# EasyEDA Pro project OpenIPC-Optical(工程文件)2025-11-24.epro, board PCB1
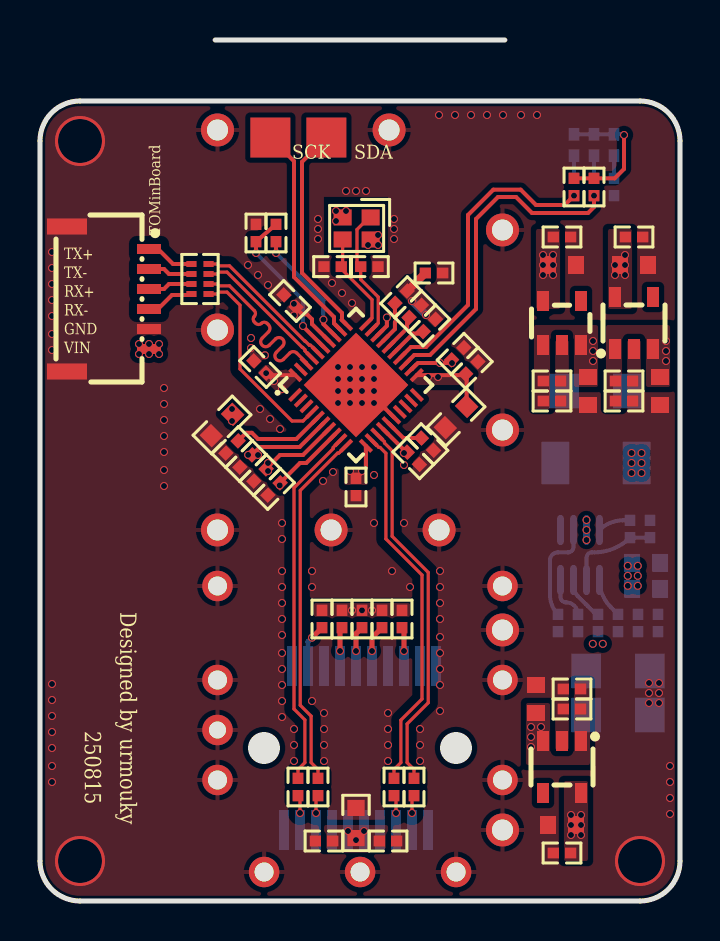
[diagram p5: board, top side]
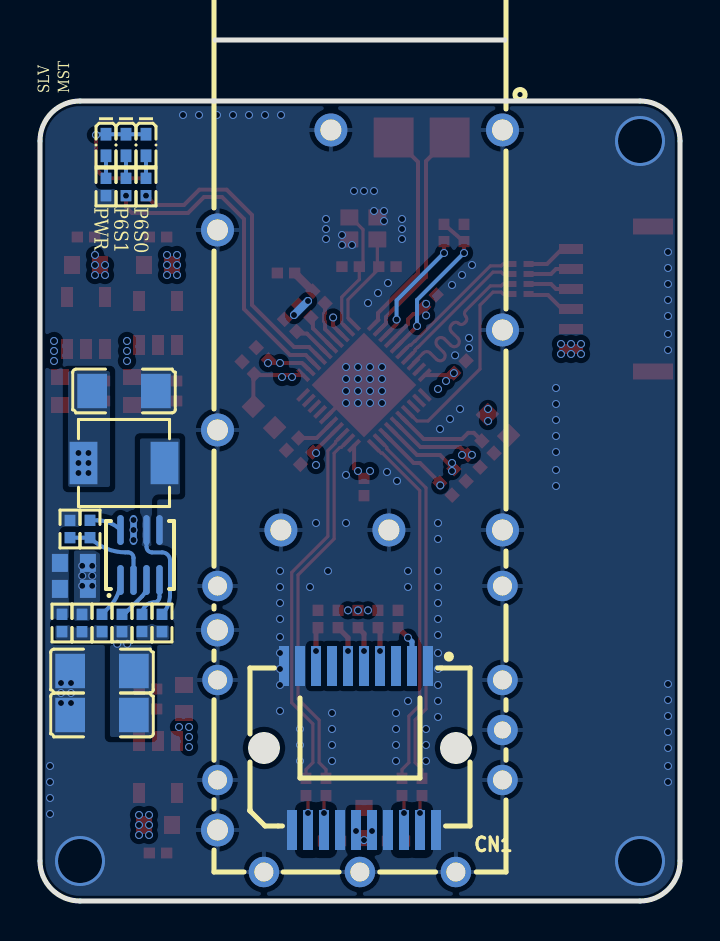
[diagram p6: board, bottom side, seen from below]

Outline 32 x 43.05 mm; copper layers: Top Layer, Inner1, Inner2, Bottom Layer. Coordinates in mm from the lower left corner of the outline.
Outline path: 0,38 0,2 arc(0.59,0.59) 2,0 30,0 arc(31.41,0.59) 32,2 32,38 arc(31.41,39.41) 30,40 2,40 arc(0.59,39.41) 0,38
Stack: Top Layer 0.035mm 外层铜厚1oz / Dielectric1 0.2104mm 7628 RC49% 8.6mil / Inner1 0.0152mm 内层铜厚 / Dielectric2 1.065mm 1.1mm H/HOZ Copper / Inner2 0.0152mm 内层铜厚 / Dielectric3 0.2104mm 7628 RC49% 8.6mil / Bottom Layer 0.035mm 外层铜厚1oz

## Design rules (mm)
net $1N1852: DP3
net $1N1912: DP3
net HSON: 100M以太网差分线, DP1
net SFP_TX_N: SFP差分线
net HSOP: 100M以太网差分线, DP1
net SFP_TX_P: SFP差分线
net HSIP: 100M以太网差分线, DP2
net SFP_RX_P: SFP差分线
net HSIN: 100M以太网差分线, DP2
net SFP_RX_N: SFP差分线
net P0MDICP: SFP差分线
net P0MDICN: SFP差分线
net P0MDIDP: SFP差分线
net P0MDIDN: SFP差分线, DP5
net P0MDIBN: SFP差分线
net P0MDIBP: SFP差分线, DP5
net P0MDIAN: SFP差分线, DP4
net P0MDIAP: SFP差分线, DP4
net ETH_RX-: 100M以太网差分线
net ETH_TX-: 100M以太网差分线
net ETH_RX+: 100M以太网差分线
net ETH_TX+: 100M以太网差分线
template: 自定义配置
spacing copperThickness1oz (default): track to track 0.102, other pairs 0.152 to 0.3
spacing copperThickness2oz: track to track 0.203, other pairs 0.152 to 0.3
spacing 高速信号: track to track 0.152, other pairs 0.152 to 0.3
track width copperThickness1oz (default): min 0.127, default 0.2, max 2.54
track width copperThickness2oz: min 0.203, default 0.254, max 2.54
differential pair differentialPair (default): width min 0.127, default 0.254, max 2.54; gap min 0.152, default 0.152
via viaSize (default): diameter min 0.4, default 0.4, max 10; hole min 0.3, default 0.3, max 6.3
net class SFP差分线 uses 高速信号
net class 100M以太网差分线 uses 高速信号
net HSON uses 高速信号
net SFP_TX_N uses 高速信号
net HSOP uses 高速信号
net SFP_TX_P uses 高速信号
net HSIP uses 高速信号
net SFP_RX_P uses 高速信号
net HSIN uses 高速信号
net SFP_RX_N uses 高速信号
net P0MDICP uses 高速信号
net P0MDICN uses 高速信号
net P0MDIDP uses 高速信号
net P0MDIDN uses 高速信号
net P0MDIBN uses 高速信号
net P0MDIBP uses 高速信号
net P0MDIAN uses 高速信号
net P0MDIAP uses 高速信号
net ETH_RX- uses 高速信号
net ETH_TX- uses 高速信号
net ETH_RX+ uses 高速信号
net ETH_TX+ uses 高速信号
['net class', '100m以太网差分线'] ['NET', 'GND'] uses copperThickness2oz
['net class', '100m以太网差分线'] ['NET', 'GND'] uses 高速信号
['net class', 'sfp差分线'] ['NET', 'GND'] uses 高速信号

## Placement (name value [footprint] x y rotation side)
C1  18pF  [R0402]  16.47 31.72 0 top
C2  18pF  [R0402]  14.63 31.72 0 top
C3  100nF  [R0402]  20.88 27.36 225 top
C4  100nF  [R0402]  11.7 20.6 45 top
C5  100nF  [R0402]  12.5 30 315 top
C6  100nF  [R0402]  15.8 20.7 90 top
C7  100nF  [R0402]  10.3 22 45 top
C8  100nF  [R0402]  11 26.7 315 top
C9  10uF  [R0603]  20.8 24.2 45 top
C10  100nF  [R0402]  10.8 33.4 270 top
C11  100nF  [R0402]  11 21.3 45 top
C12  100nF  [R0402]  19.7 31.4 180 top
C13  100nF  [R0402]  18.66 22.14 135 top
C14  100nF  [R0402]  21.59 26.66 225 top
C15  22uF  [C0603]  30.31 15.61 180 bottom
C18  47uF  [C1206]  28.9 9.3 180 bottom
C19  47uF  [C1206]  28.9 11.5 180 bottom
C20  100nF  [C0402]  26.9 13.9 270 bottom
C46  100nF  [R0402]  29.2 26 0 top
C68  100nF  [R0402]  17.4 3 180 top
C69  1uF  [R0603]  15.8 3.9 270 top
C70  100nF  [R0402]  12.9 5.7 90 top
C71  100nF  [R0402]  13.9 5.7 90 top
C72  100nF  [R0402]  17.7 5.7 90 top
C73  100nF  [R0402]  18.7 5.7 90 top
C75  10uF  [R0603]  9.1 23.8 45 top
C76  100nF  [R0402]  14.2 3 0 top
C77  22uF  [C0603]  30.31 16.91 180 bottom
C78  100nF  [C0402]  30.5 18.6 270 bottom
C80  22uF  [C0603]  29.7 31.8 180 top
C81  100nF  [R0402]  29.2 25 180 top
C84  22uF  [C0603]  26.1 3.8 0 top
C85  100nF  [R0402]  26.6 10.6 0 top
C88  100nF  [R0402]  26.6 9.6 180 top
C93  47uF  [C1206]  27.8 25.5 180 bottom
C94  22uF  [C0603]  24.8 10.1 270 top
C95  22uF  [C0603]  31 25.5 90 top
C96  100nF  [R0402]  29.7 33.2 0 top
C97  100nF  [R0402]  26.1 2.4 180 top
C98  22uF  [C0603]  26.1 31.8 180 top
C99  100nF  [R0402]  25.6 25 180 top
C100  100nF  [R0402]  25.6 26 0 top
C101  22uF  [C0603]  27.4 25.5 90 top
C102  100nF  [R0402]  26.1 33.2 0 top
CN1  HC-SFP-20P  [CONN-SMD_20P-P0.80_HCTL_HC-SFP-20P]  16 7.65 0 bottom
L1  10uH  [IND-SMD_L4.4-W4.2]  27.8 21.9 180 bottom
P6S0  NCD0402G1  [LED0402-RD]  26.7 37.8 270 bottom
P6S1  NCD0402G1  [LED0402-RD]  27.7 37.8 270 bottom
PWR  NCD0402G1  [LED0402-RD]  28.7 37.8 270 bottom
R1  4.7kΩ  [R0402]  18.05 30.19 45 top
R2  4.7kΩ  [R0402]  19.47 28.78 225 top
R3  4.7kΩ  [R0402]  26.7 35.7 90 top
R4  4.7kΩ  [R0402]  27.7 35.7 90 top
R5  470Ω  [R0402]  27.7 35.7 90 bottom
R6  470Ω  [R0402]  26.7 35.7 90 bottom
R9  2.49kΩ  [R0402]  9.6 22.7 45 top
R10  4.7kΩ  [R0402]  11.8 33.4 90 top
R11  4.7kΩ  [R0402]  19.37 22.84 135 top
R16  51kΩ  [R0402]  28.9 13.9 270 bottom
R17  41.2kΩ  [R0402]  29.9 13.9 90 bottom
R20  7.68kΩ  [R0402]  30.9 13.9 270 bottom
R82  10kΩ  [R0402]  14.1 14.1 90 top
R83  10kΩ  [R0402]  15.1 14.1 90 top
R86  10kΩ  [R0402]  16.1 14.1 90 top
R87  10kΩ  [R0402]  17.1 14.1 90 top
R90  10kΩ  [R0402]  18.1 14.1 90 top
R95  4.7kΩ  [R0402]  18.76 29.48 45 top
R96  1MΩ  [R0402]  27.9 13.9 90 bottom
R97  100kΩ  [R0402]  29.5 18.6 90 bottom
R98  20Ω  [R0402]  25.9 13.9 270 bottom
R99  470Ω  [R0402]  28.7 35.7 90 bottom
RN1  49.9Ω  [RES-ARRAY-SMD_0402-8P-L2.0-W1.0-BL]  8 31.1 90 top
SCK  -  [Test-Point-0.5mm]  11.52 38.17 0 top
SDA  -  [Test-Point-0.5mm]  14.32 38.17 0 top
TOMinBoard  HDGC1002WR-S-6P  [CONN-SMD_6P-P1.00_HDGC1002WR-S-6P]  3.4 30.1 270 top
U1  RTL8213B-CG  [QFN-40_L5.0-W5.0-P0.40-BL-EP3.7]  15.8 25.8 315 top
U2  MP9943GQ-Z  [QFN-8_L3.0-W3.0-P0.65-BL]  27 17.3 180 bottom
U6  HC-SFP-01L  [TH_HC-SFP-01L]  16 20 270 bottom
U7  ME6217C33M5G  [SOT-23-5_L3.0-W1.7-P0.95-LS2.8-BR]  29.7 28.9 270 top
U8  ME6217C33M5G  [SOT-23-5_L3.0-W1.7-P0.95-LS2.8-BR]  26.1 6.7 90 top
U10  TLV74018PDBVR  [SOT-23-5_L2.9-W1.6-P0.95-LS2.8-BL]  26.1 28.9 0 top
X2  25MHz  [CRYSTAL-SMD_4P-L2.0-W1.6-BL]  15.83 33.63 180 top

## Footprints (pads in the part's own frame, mm; a bottom-side part is the same pattern mirrored in y, then rotated)
C0402
  rect 0.567x0.54 smd: 1(-0.432,0) 2(0.432,0)
C0603
  rect 0.8x0.9 smd: 1(-0.7,0) 2(0.7,0)
C1206
  rect 1.485x1.728 smd: 1(-1.593,0) 2(1.593,0)
CONN-SMD_6P-P1.00_HDGC1002WR-S-6P
  rect 0.5x1.2 smd: 1(-2.5,2.05) 2(-1.5,2.05) 3(-0.5,2.05) 4(0.5,2.05) 5(1.5,2.05) 6(2.5,2.05)
  rect 0.8x2 smd: 7(3.625,-2.05) 8(-3.625,-2.05)
CONN-SMD_20P-P0.80_HCTL_HC-SFP-20P
  rect 0.5x2 smd: 1(-3.4,-4.1) 2(-2.6,-4.1) 3(-1.8,-4.1) 4(-1,-4.1) 5(-0.2,-4.1) 6(0.6,-4.1) 7(1.4,-4.1) 8(2.2,-4.1) 9(3,-4.1) 10(3.8,-4.1) 11(3.4,4.1) 12(2.6,4.1) 13(1.8,4.1) 14(1,4.1) 15(0.2,4.1) 16(-0.6,4.1) 17(-1.4,4.1) 18(-2.2,4.1) 19(-3,4.1) 20(-3.8,4.1)
CRYSTAL-SMD_4P-L2.0-W1.6-BL
  rect 0.9x0.8 smd: 1(-0.7,-0.55) 2(0.7,-0.55) 3(0.7,0.55) 4(-0.7,0.55)
IND-SMD_L4.4-W4.2
  rect 1.4x2.12 smd: 1(2.028,0) 2(-2.028,0)
LED0402-RD
  rect 0.636x0.54 smd: 1(-0.538,0) 2(0.538,0)
QFN-8_L3.0-W3.0-P0.65-BL
  oval 0.33x1.5 smd: 1(-0.975,-1.25) 2(-0.325,-1.25) 3(0.325,-1.25) 4(0.975,-1.25) 5(0.975,1.25) 6(0.325,1.25) 7(-0.325,1.25) 8(-0.975,1.25)
QFN-40_L5.0-W5.0-P0.40-BL-EP3.7
  rect 0.2x0.8 smd: 1(-1.8,-2.499) 2(-1.4,-2.499) 3(-1,-2.499) 4(-0.6,-2.499) 5(-0.2,-2.499) 6(0.2,-2.499) 7(0.6,-2.499) 8(1,-2.499) 9(1.4,-2.499) 10(1.8,-2.499) 21(1.8,2.499) 22(1.4,2.499) 23(1,2.499) 24(0.6,2.499) 25(0.2,2.499) 26(-0.2,2.499) 27(-0.6,2.499) 28(-1,2.499) 29(-1.4,2.499) 30(-1.8,2.499)
  rect 0.8x0.2 smd: 11(2.499,-1.8) 12(2.499,-1.4) 13(2.499,-1) 14(2.499,-0.6) 15(2.499,-0.2) 16(2.499,0.2) 17(2.499,0.6) 18(2.499,1) 19(2.499,1.4) 20(2.499,1.8) 31(-2.499,1.8) 32(-2.499,1.4) 33(-2.499,1) 34(-2.499,0.6) 35(-2.499,0.2) 36(-2.499,-0.2) 37(-2.499,-0.6) 38(-2.499,-1) 39(-2.499,-1.4) 40(-2.499,-1.8)
  rect 3.7x3.7 smd: 41(0,0)
R0402
  rect 0.566x0.54 smd: 1(-0.433,0) 2(0.433,0)
R0603
  rect 0.806x0.864 smd: 1(-0.753,0) 2(0.753,0)
RES-ARRAY-SMD_0402-8P-L2.0-W1.0-BL
  rect 0.3x0.505 smd: 1(-0.75,0.427) 2(-0.25,0.427) 3(0.25,0.427) 4(0.75,0.427) 5(0.75,-0.427) 6(0.25,-0.427) 7(-0.25,-0.427) 8(-0.75,-0.427)
SOT-23-5_L2.9-W1.6-P0.95-LS2.8-BL
  rect 0.6x1 smd: 1(-0.95,-1.1) 2(0,-1.1) 3(0.95,-1.1) 4(0.95,1.1) 5(-0.95,1.1)
SOT-23-5_L3.0-W1.7-P0.95-LS2.8-BR
  rect 1x0.6 smd: 1(1.3,-0.95) 2(1.3,0) 3(1.3,0.95) 4(-1.3,0.95) 5(-1.3,-0.95)
Test-Point-0.5mm
  rect 2x2 smd: 1(0,0)
TH_HC-SFP-01L
  round 1.65 hole 1.05: 1(-18.55,7.125) 2(-8.55,7.125) 3(1.45,7.125) 11(16.45,-7.125) 14(6.45,-7.125) 16(-3.55,-7.125) 17(-13.55,-7.125) 18(-18.55,-1.455) 19(1.45,-3.955) 20(1.45,1.445)
  round 1.524 hole 0.95: 4(4.25,7.125) 5(8.95,7.125) 7(13.95,7.125) 8(18.55,4.795) 9(18.55,-0.005) 10(18.55,-4.805) 12(13.95,-7.125) 13(8.95,-7.125) 15(4.25,-7.125)
  round 1.524 hole 0.85: 6(11.45,7.125)

## Nets
As in the schematic.

Pads without a net: CN1 3 7; U1 17 18 19 20; U7 4; U8 4; U10 4

## Via types
v1: diameter 0.4, hole 0.3, Top Layer to Bottom Layer, 221 vias
v2: diameter 2.5, hole 2.2, Top Layer to Bottom Layer, 3 vias

## Routing (per net, layer and track width the routed paths; a pad name or vN(x,y) marks a point on that pad's centre or on a via; arc(x,y) is an arc through that point)
4V5:
  vias: v1(24.55,8.7) v1(24.55,8.2) v1(24.55,7.7) v1(25.05,8.7) v1(27.65,28) v1(27.65,27.5) v1(27.65,27) v1(29.39,16.76) v1(29.39,16.26) v1(29.39,15.76) v1(29.58,22.4) v1(29.58,21.9) v1(29.58,21.4) v1(29.89,16.76) v1(29.89,16.26) v1(29.89,15.76) v1(30.08,22.4) v1(30.08,21.9) v1(30.08,21.4) v1(31.3,28) v1(31.3,27.5) v1(31.3,27)
GND: length 2.6
  Top Layer w0.2: U1.16 16.08,25.8 U1.41
  vias: v1(0.6,32.45) v1(0.6,31.65) v1(0.6,30.85) v1(0.6,30.05) v1(0.6,29.25) v1(0.6,28.35) v1(0.6,27.55) v1(0.6,10.85) v1(0.6,10.05) v1(0.6,9.25) v1(0.6,8.45) v1(0.6,7.65) v1(0.6,6.75) v1(0.6,5.95) v1(6.2,25.65) v1(6.2,24.85) v1(6.2,24.05) v1(6.2,23.25) v1(6.2,22.45) v1(6.2,21.55) v1(6.2,20.75) v1(10.4,31.8) v1(10.55,28.15) v1(10.55,27.65) v1(10.9,31.3) v1(11,24.6) v1(11.25,27.29) v1(11.4,30.8) v1(11.5,24.1) v1(12,23.6) v1(12.1,18.9) v1(12.1,18.1) v1(12.1,16.5) v1(12.1,15.7) v1(12.1,14.9) v1(12.1,14.1) v1(12.1,13.3) v1(12.1,12.4) v1(12.1,11.6) v1(12.1,10.8) v1(12.1,10) v1(12.1,9.2) v1(12.7,8.6) v1(12.7,7.8) v1(12.7,7) v1(13.6,16.5) v1(13.6,15.7) v1(13.6,10) v1(13.9,34.1) v1(13.9,33.6) v1(13.9,33.1) v1(14.15,21) v1(14.2,9.4) v1(14.2,8.6) v1(14.2,7.8) v1(14.2,7) v1(14.6,30.9) v1(14.65,21.45) v1(14.8,34.5) v1(14.8,34) v1(14.9,26.7) v1(14.9,26.1) v1(14.9,25.5) v1(14.9,24.9) v1(15.1,30.4) v1(15.3,35.5) v1(15.3,34.5) v1(15.5,26.7) v1(15.5,26.1) v1(15.5,25.5) v1(15.5,24.9) v1(15.6,29.9) v1(15.8,35.5) v1(16.1,26.7) v1(16.1,26.1) v1(16.1,25.5) v1(16.1,24.9) v1(16.3,35.5) v1(16.4,32.8) v1(16.7,26.7) v1(16.7,26.1) v1(16.7,25.5) v1(16.7,24.9) v1(16.7,21.3) v1(16.7,18.9) v1(16.9,33.3) v1(16.9,32.8) v1(17.4,9.4) v1(17.4,8.6) v1(17.4,7.8) v1(17.4,7) v1(17.6,16.5) v1(17.7,34.1) v1(17.7,33.6) v1(17.7,33.1) v1(18.2,18.9) v1(18.5,15.7) v1(19,8.6) v1(19,7.8) v1(19,7) v1(19.95,39.3) v1(20,16.5) v1(20,15.7) v1(20,14.9) v1(20,14.1) v1(20,13.2) v1(20,12.4) v1(20,11.6) v1(20,10.8) v1(20,9.5) v1(20.75,39.3) v1(21.55,39.3) v1(22.35,39.3) v1(23.15,39.3) v1(24.05,39.3) v1(24.85,39.3) v1(30.45,10.9) v1(30.45,10.4) v1(30.45,9.9) v1(30.95,10.9) v1(30.95,10.4) v1(30.95,9.9) v1(31.5,6.75) v1(31.5,5.95) v1(31.5,5.15) v1(31.5,4.35) v2(2,38) v2(2,2) v2(30,2)
VBAT: length 38.9
  Inner2 w0.2: v1(28.14,12.86) v1(27.64,12.86) arc(27.41,13.21) 27.32,13.62 v1(27.32,18.05) v1(27.32,18.55) v1(27.32,19.05)
  Inner2 w0.7: v1(5.45,27.85) v1(5.45,27.35) 5.45,18.45 6.7,17.2 26.48,17.2 v1(27.32,18.05)
  vias: v1(4.95,27.85) v1(4.95,27.35) v1(5.95,27.85) v1(5.95,27.35)
8213B_1V0: length 50.3
  Top Layer w0.2: 20.47,26.96 20.42,26.9 v1(20,26.9) 18.9,26.9 18.59,26.59 arc(18.58,26.58) U1.22 ; U1.11 16.29,21.63 15.8,21.13 ; U1.40 11.61,26.29 11.51,26.19 ; C5.2 12.81,29.64 13.1,29.35 13.34,29.35 13.6,29.09 13.6,28.85 U1.34 ; C7.2 11,22.7 12.98,22.7 U1.6 ; U1.8 13.31,21.9 13,21.9 C4.2
  Inner2 w0.2: v1(20,26.9) 20.7,26.9
  Inner2 w0.4: 12,20.4 11.4,20.4 9.6,22.2 9.6,22.3 ; 12,20.4 18.1,20.4 19.3,21.6 19.3,24.2 25.15,30.05 v1(25.15,31.3) ; 12,20.4 12,20.77 v1(11.99,20.78) ; v1(10.9,22.3) 9.6,22.3 ; 9.6,22.3 v1(9.6,24)
  Inner2 w0.5: v1(25.65,31.8) v1(25.15,31.3) ; 10,24.1 9.6,24.5 v1(9.6,24.6) 9.6,24.69 v1(11.31,26.39) 12,27.09 12,28.58 v1(12.7,29.28)
  vias: v1(10.41,22.31) v1(11.7,26) v1(12.1,25.6) v1(12.7,29.86) v1(15.5,21.5) v1(16.1,21.5) v1(20.6,26.9) v1(25.15,32.3) v1(25.15,31.8) v1(25.65,32.3) v1(25.65,31.3)
8213B_3V3: length 70.6
  Top Layer w0.2: C11.2 12,22.3 13.15,22.3 U1.7 ; U1.14 18.31,22.44 18.36,22.44 ; 11.8,33.83 C10.2 v1(10.8,32.4) ; U1.35 13.15,28.73 v1(13.15,28.75) ; v1(29.2,38.3) 29.2,36.6 28.73,36.13 26.7,36.13 ; U1.21 21.14,26.29 21.33,26.1 C9.2 ; U1.28 17.34,28.76 v1(17.34,29.18)
  Top Layer w0.4: C12.2 18.37,30.5 18.36,30.5
  Inner2 w0.5: v1(29.2,38.3) 29.25,38.25 v1(29.25,32.3) 28.75,32.3 v1(28.75,31.8) ; 13.6,28.3 v1(13.15,28.75) ; 18.9,26.2 v1(19.4,26.2) v1(19.9,26.2) ; 18.9,26.2 19.3,26.6 19.3,27.7 20.1,28.5 ; 18.9,26.2 17,24.3 ; 17,24.3 18.2,23.1 v1(18.2,22.4) v1(18.2,21.8) ; 17,24.3 15.9,23.2 12.65,23.2 11.4,21.95 v1(11.4,21.5) ; 13.6,28.3 16.47,28.3 v1(17.34,29.18) 18.17,30 v1(18.6,30) ; 20.1,28.5 v1(19.3,29.3) ; 20.1,28.5 24.9,33.3 26.1,33.3 27.6,31.8 v1(28.75,31.8) ; v1(28.75,31.8) v1(29.25,31.8)
  Bottom Layer w0.2: v1(29.2,38.3) 29.16,38.34 PWR.1 P6S1.1 P6S0.1 ; v1(10.8,32.4) 13.15,30.05 v1(13.15,28.75)
  Bottom Layer w0.4: v1(19.3,29.3) v1(18.6,30)
  vias: v1(11.4,21.9) v1(28.75,31.3) v1(29.25,31.3)
8213B_EN_SWR: length 1.9
  Top Layer w0.2: U1.15 18.17,23.15 R11.2
8213B_SCK: length 11.1
  Top Layer w0.2: U1.32 14.7,28.88 14.7,29.2 12.7,31.2 12.7,36.99 SCK.1
8213B_SDA: length 10.8
  Top Layer w0.2: SDA.1 13.1,36.96 13.1,31.4 15.1,29.4 15.1,29.05 U1.31
ETH_RX+: length 2.2
  Top Layer w0.2: TOMinBoard.3 6.2,30.6 6.45,30.85 RN1.2
ETH_RX-: length 2.4
  Top Layer w0.2: RN1.1 7.52,30.3 6.6,30.3 5.9,29.6 TOMinBoard.4
ETH_TX+: length 2.4
  Top Layer w0.2: RN1.4 6.65,31.85 5.9,32.6 TOMinBoard.1
ETH_TX-: length 2.2
  Top Layer w0.2: RN1.3 6.45,31.35 6.2,31.6 TOMinBoard.2
FB_5V: length 2
  Bottom Layer w0.2: 28.9,14.33 28.54,14.7 arc(28.12,15.32) U2.1
HSIN: length 18.8
  Top Layer w0.16: U1.13 17.22,22.96 17.22,22.9 17.61,22.52 17.61,18.23 19.41,16.43 19.41,9.91 18.36,8.86 18.36,6.92 18.7,6.58 18.7,6.13
HSIP: length 18.6
  Top Layer w0.16: U1.12 16.94,22.68 17,22.68 17.29,22.39 17.29,18.11 19.1,16.3 19.1,10.1 18.04,9.04 18.04,6.92 17.7,6.58 17.7,6.13
HSON: length 18.2
  Top Layer w0.16: U1.9 14.66,22.68 14.66,22.62 12.7,20.66 12.7,9.6 13.24,9.06 13.24,6.92 12.9,6.58 12.9,6.13
HSOP: length 18
  Top Layer w0.16: 13.9,6.13 13.9,6.58 13.56,6.92 13.56,9.24 13.01,9.79 13.01,20.53 14.88,22.4 14.94,22.4 U1.10
LC_5V: length 5.2
  Bottom Layer w0.2: U2.6 26.68,17.71 arc(26.59,17.51) 26.4,17.43 25.9,17.43 arc(25.62,17.31) 25.5,17.03 25.5,15.3 arc(25.6,14.78) 25.9,14.33
P0MDIAN: length 7
  Top Layer w0.16: RN1.6 8.84,31.35 8.93,31.44 9.35,31.44 13.11,27.68 13.13,27.68 13.25,27.57 13.25,27.51 U1.37
P0MDIAP: length 7.3
  Top Layer w0.16: U1.36 13.53,27.79 13.47,27.79 13.26,27.99 13.24,27.99 9.48,31.76 8.93,31.76 8.84,31.85 RN1.5
P0MDIBP: length 9.9
  Top Layer w0.16: U1.38 13.33,26.91 12.84,27.4 arc(12.66,27.47) 12.48,27.4 12.17,27.08 arc(11.82,27.08) 11.82,27.44 12.13,27.75 arc(12.13,28.1) 11.78,28.1 11.46,27.79 arc(11.11,27.79) 11.11,28.14 11.42,28.46 arc(11.5,28.63) 11.42,28.81 11.35,28.88 arc(11.21,28.94) 11.07,28.88 arc(10.93,28.82) 10.79,28.88 10.72,28.95 arc(10.66,29.09) 10.72,29.24 arc(10.77,29.38) 10.72,29.52 9.48,30.76 8.93,30.76 8.84,30.85 RN1.7
P0MDIDN: length 9.9
  Top Layer w0.16: U1.4 13.15,24 12.6,24 10,26.6 10,29.79 9.35,30.44 8.93,30.44 8.84,30.35 RN1.8
P3LED0: length 2.2
  Top Layer w0.2: U1.27 17.75,28.59 17.75,28.94 17.8,28.99 17.8,29.36 17.75,29.41 R1.1
P3LED1: length 1.8
  Top Layer w0.2: U1.26 18.35,28.64 18.35,29.08
P3LED2: length 1.7
  Top Layer w0.2: U1.25 18.65,28.37 19.06,28.37
P6LED0: length 15.3
  Top Layer w0.2: v1(26.7,35.27) 26.23,34.8 24.8,34.8 24.03,35.57 22.67,35.57 21.4,34.3 21.4,29.8 19.3,27.7 18.55,27.7 U1.24
P6LED1: length 16.5
  Top Layer w0.2: U1.23 18.71,27.3 19.5,27.3 21.8,29.6 21.8,34.1 22.9,35.2 23.8,35.2 24.6,34.4 27.4,34.4 27.7,34.7 v1(27.7,35.27)
SFP_3V3:
  vias: v1(15.4,3.5) v1(15.6,14.53) v1(15.8,3.05) v1(16.1,14.53) v1(16.2,3.5) v1(16.6,14.53) v1(26.55,4.3) v1(26.55,3.8) v1(26.55,3.3) v1(27.05,4.3) v1(27.05,3.8) v1(27.05,3.3)
SFP_RX_N: length 0.9
  Top Layer w0.16: v1(18.6,4.4) 18.6,5.17 C73.1
SFP_RX_P: length 0.9
  Top Layer w0.16: v1(17.8,4.4) 17.8,5.17 C72.1
SFP_TX_N: length 0.9
  Top Layer w0.16: v1(13,4.4) 13,5.17 C70.1
SFP_TX_P: length 0.9
  Top Layer w0.16: C71.1 13.8,5.17 v1(13.8,4.4)
$1N1852: length 6.5
  Top Layer w0.16: U1.29 16.91,28.89 16.91,30.2 16.03,31.08 C1.1 15.85,31.9 15.85,33.57 16.45,34.18 X2.1
$1N1863: length 5.9
  Top Layer w0.2: v1(14.17,29.07) 14.17,28.84 U1.33 ; v1(11.8,32.4) R10.1
  Bottom Layer w0.2: v1(14.17,29.07) 14.17,30.03 v1(11.8,32.4)
$1N1904: length 4.7
  Top Layer w0.2: U1.5 12.82,23.1 10.9,23.1 10.59,23.41 10.31,23.41 R9.2
$1N1912: length 5
  Top Layer w0.16: U1.30 16.6,29.15 16.6,30.07 15.06,31.61 C2.2 15.13,31.79 X2.3
$1N1945: length 1.1
  Bottom Layer w0.2: 27.7,36.13 P6S1.2
$1N1946: length 1.1
  Bottom Layer w0.2: P6S0.2 26.7,36.13
$1N2817: length 1.3
  Top Layer w0.254: 16.1,13.67 15.8,13.37 v1(15.8,12.5)
$1N2818: length 1.2
  Top Layer w0.254: v1(15,12.5) 15,13.57 15.1,13.67
$1N2820: length 1.4
  Top Layer w0.254: v1(16.6,12.5) 16.6,13.17 17.1,13.67
$1N2821: length 2.2
  Top Layer w0.254: 14.1,13.67 v1(13.6,13.17)
  Bottom Layer w0.254: CN1.2 13.4,12.97 v1(13.6,13.17)
$1N2827: length 1.2
  Top Layer w0.254: 18.1,13.67 18.2,13.57 v1(18.2,12.5)
$1N6453: length 1.1
  Bottom Layer w0.2: PWR.2 28.7,36.13
$2N900: length 1.7
  Bottom Layer w0.2: R97.2 29.14,19.03 arc(28.51,18.91) U2.8
$2N903: length 4.6
  Bottom Layer w0.2: U2.2 27.32,17.16 arc(27.41,17.35) 27.6,17.43 27.72,17.43 arc(28.68,17.62) 29.5,18.17 30.5,18.17 arc(30.5,18.17) C78.2
$2N915: length 2.2
  Bottom Layer w0.2: U2.4 26.03,15.21 arc(26.11,15.01) 26.3,14.93 arc(26.72,14.76) C20.1
$2N918: length 2.2
  Bottom Layer w0.2: U2.3 26.68,15.78 arc(26.73,15.48) 26.9,15.23 27.3,14.83 arc(27.35,14.79) 27.38,14.75 27.73,14.4 arc(27.81,14.35) 27.9,14.33

## Copper pours and planes (outline as drawn; the poured copper is in the pictures)
4V5 on Top Layer: 31.5,25.7 30.3,25.7 30.3,28.1 30.1,28.3 29.3,28.3 29.1,28.1 29.1,24.6 28.3,24.6 28.3,28.8 31.5,28.8
4V5 on Top Layer: 24.3,9.9 25.5,9.9 25.5,7.5 25.7,7.3 26.5,7.3 26.7,7.5 26.7,11 27.5,11 27.5,6.8 24.3,6.8
4V5 on Top Layer: 27.9,25.7 26.7,25.7 26.7,28.1 26.5,28.3 25.7,28.3 25.5,28.1 25.5,24.6 24.7,24.6 24.7,28.8 27.9,28.8
4V5 on Bottom Layer: 29.5,13.93 30.3,13.93 30.3,17.53 29,17.53 29,14.93 29.5,14.93
4V5 on Bottom Layer: 28.5,26.5 28.5,20.7 30.6,20.7 30.6,26.5
4V5 on Inner2: 29.34,22.66 29.34,17.6 29.31,17.47 29.17,17.25 29.14,17.12 29.14,15.46 30.14,15.46 30.14,20.52 30.17,20.65 30.31,20.87 30.34,21 30.34,22.66
4V5 on Inner2: 28.9,22.4 28.9,11.2 26.6,11.2 26.6,10.1 24.2,10.1 24.2,7.3 32,7.3 32,22.4
4V5 on Inner2: 26.6,28.4 32,28.4 32,22.2 27.1,22.2 24.5,24.8 24.5,26.3
GND on Top Layer: 0,40 32,40 32,0 0,0
GND on Bottom Layer: 0,40 32,40 32,0 0,0
GND on Inner1: 0,40 32,40 32,0 0,0
GND on Inner2: 0,40 32,40 32,0 0,0
VBAT on Bottom Layer: 28.5,12.8 28.5,8.2 26.4,8.2 26.4,12.8
VBAT on Bottom Layer: 27.44,13.86 27.44,12.66 28.34,12.66 28.34,13.86
VBAT on Inner2: 6.2,28.1 4.7,28.1 4.7,27.1 6.2,27.1
VBAT on Inner2: 28.8,19.6 28.8,12.4 26.4,12.4 26.4,19.6
8213B_1V0 on Top Layer: 10.7,26.3 12,25 13.1,26.1 12.4,26.8 11.2,26.8
8213B_1V0 on Top Layer: 26,33.6 24.8,33.6 24.8,29.6 26,29.6
8213B_1V0 on Top Layer: 12.8,30.3 12.1,29.6 12.9,28.8 13.6,29.5
8213B_1V0 on Top Layer: 15.2,21.7 16.4,21.7 16.4,20.8 15.2,20.8
8213B_1V0 on Inner2: 15.2,21.7 16.4,21.7 16.4,20.4 15.2,20.4
8213B_1V0 on Inner2: 24.8,32.6 26,32.6 26,31 24.8,31
8213B_1V0 on Inner2: 9.8,22.2 11.5,22.2 11.5,20.5
8213B_1V0 on Inner2: 19.8,27.1 19.8,26.5 21.9,26.5 21.9,27.1
8213B_1V0 on Inner2: 32,40 32,28.6 26.5,28.6 24.4,26.5 24.4,21.3 22.5,19.4 6.6,19.4 6.6,40
8213B_3V3 on Top Layer: 20.3,29.2 19.7,28.6 17.8,30.5 18.4,31.1
8213B_3V3 on Top Layer: 18.84,26.35 21.28,26.35 21.28,25.82 21.3,25.8 18.8,25.8 18.6,26 18.84,26.24
8213B_3V3 on Top Layer: 29.6,33.6 28.4,33.6 28.4,29.6 29.6,29.6
8213B_3V3 on Inner2: 12.5,28.1 12.5,26.8 10.7,25 10.7,22.5 11.6,22.5 11.7,22.4 11.7,20.9 17.9,20.9 18.7,21.7 18.7,24.3 24.4,30 24.4,32.3 25,32.9 26,32.9 28,30.9 29.7,30.9 29.7,35.4 21.3,35.4 15.5,29.6 14,29.6
8213B_3V3 on Inner2: 28.4,32.6 28.4,31 29.6,31 29.6,32.6
LC_5V on Bottom Layer: 27,17.73 27,23.13 25,23.13 25,20.33 26.06,20.33 26.19,20.31 26.3,20.23 26.37,20.12 26.4,19.99 26.4,17.73
SFP_3V3 on Top Layer: 26.2,2 27.4,2 27.4,6 26.2,6
SFP_3V3 on Top Layer: 14.2,3.8 17.4,3.8 17.4,2.6 14.2,2.6
SFP_3V3 on Top Layer: 18.5,14.9 18.5,14.1 13.7,14.1 13.7,14.9
SFP_3V3 on Inner2: 17.9,15.1 17.9,10.5 16.9,9.5 16.9,4.4 15.2,4.4 15.2,10.5 16.9,12.2 16.9,13.3 16.2,14 15.1,14 15.1,15.1
SFP_3V3 on Inner2: 27.3,4.9 27.3,0 14.2,0 14.2,3.7 15.4,4.9
$2N902 on Bottom Layer: 25.54,13.86 27.24,13.86 27.24,13.06 25.54,13.06
$2N910 on Bottom Layer: 28.54,13.86 31.24,13.86 31.24,13.06 28.54,13.06

## Text on the board
Bottom Solder Mask Layer: Full duplex for RC/VTX | Urmouky OpenIPC Optical ExtBoard
Bottom Silkscreen Layer: MST | SLV
Top Silkscreen Layer: TX+ / TX- / RX+ / RX- / GND / VIN | 250815 | Designed by urmouky
